# Altium schematic sheet 4_DspBlackfin.SchDoc
size A3; DocumentNumber: 6; SheetNumber: 6; SheetTotal: 8
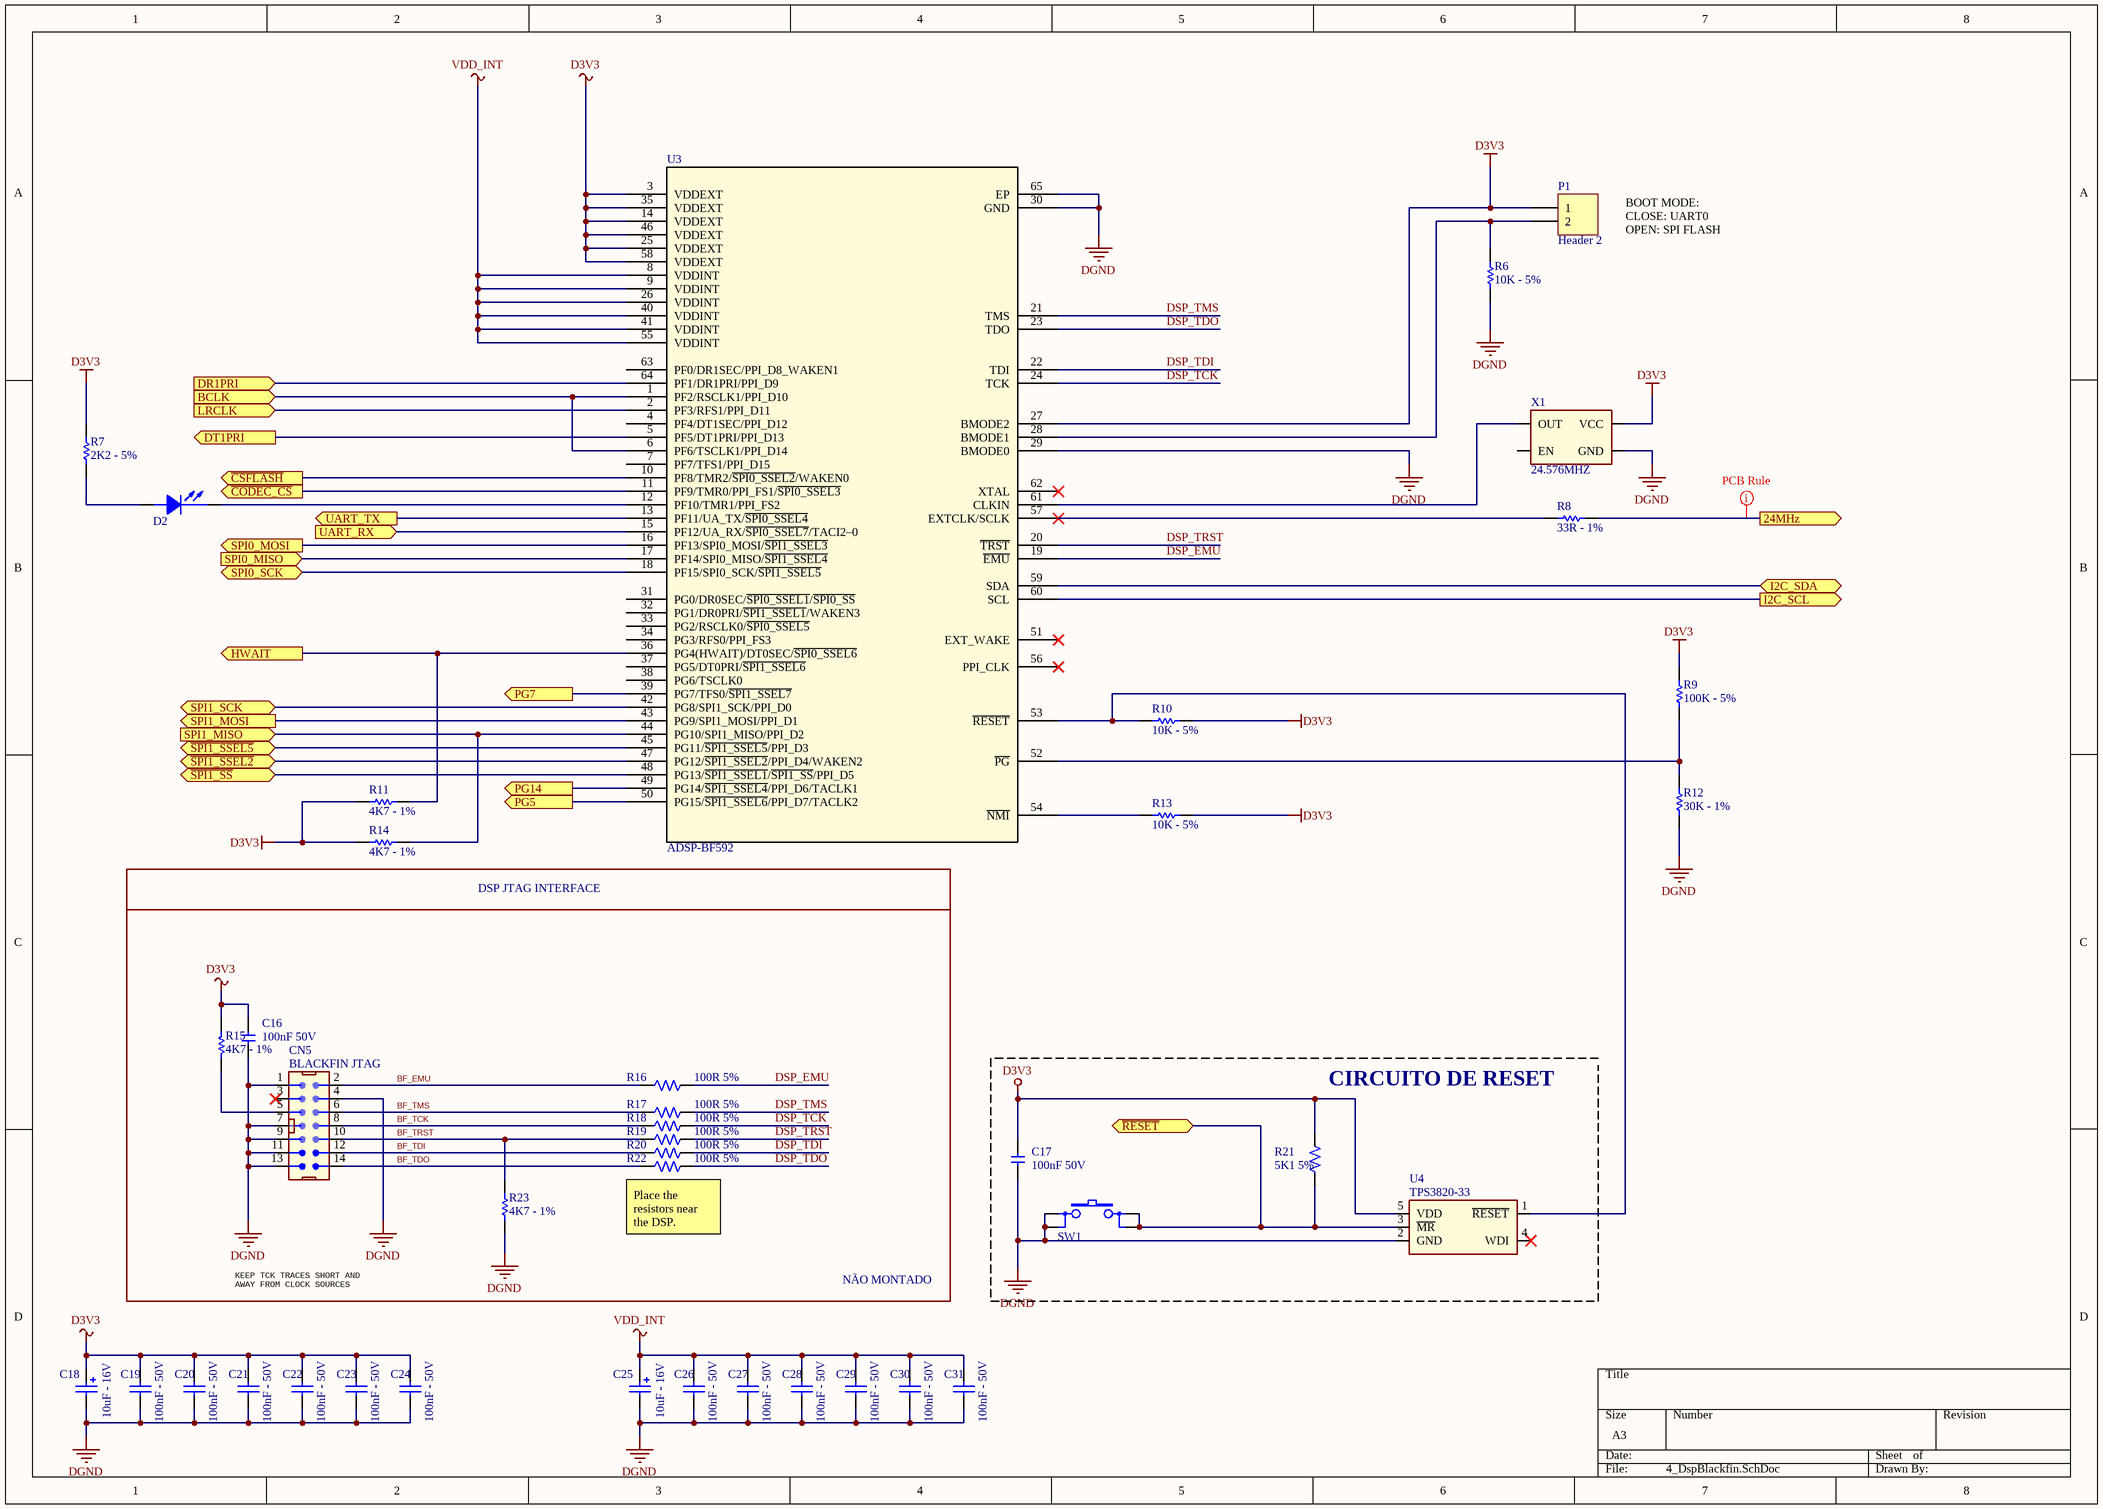
[diagram p0: 4_DspBlackfin.SchDoc]

## Parts
C16  100nF 50V  [SMD0805]
C17  100nF 50V  [SMD0805]
C18  VALOR: 10uF - 16V  [CAP/SMD/ELET/5MM/NP]  (hidden comment: Capacitor 10 uF - 20%)
C19  VALOR: 100nF - 50V  [SMD0805-CAP]  (hidden comment: Capacitor 100 nF - 10%)
C20  VALOR: 100nF - 50V  [SMD0805-CAP]  (hidden comment: Capacitor 100 nF - 10%)
C21  VALOR: 100nF - 50V  [SMD0805-CAP]  (hidden comment: Capacitor 100 nF - 10%)
C22  VALOR: 100nF - 50V  [SMD0805-CAP]  (hidden comment: Capacitor 100 nF - 10%)
C23  VALOR: 100nF - 50V  [SMD0805-CAP]  (hidden comment: Capacitor 100 nF - 10%)
C24  VALOR: 100nF - 50V  [SMD0805-CAP]  (hidden comment: Capacitor 100 nF - 10%)
C25  VALOR: 10uF - 16V  [CAP/SMD/ELET/5MM/NP]  (hidden comment: Capacitor 10 uF - 20%)
C26  VALOR: 100nF - 50V  [SMD0805-CAP]  (hidden comment: Capacitor 100 nF - 10%)
C27  VALOR: 100nF - 50V  [SMD0805-CAP]  (hidden comment: Capacitor 100 nF - 10%)
C28  VALOR: 100nF - 50V  [SMD0805-CAP]  (hidden comment: Capacitor 100 nF - 10%)
C29  VALOR: 100nF - 50V  [SMD0805-CAP]  (hidden comment: Capacitor 100 nF - 10%)
C30  VALOR: 100nF - 50V  [SMD0805-CAP]  (hidden comment: Capacitor 100 nF - 10%)
C31  VALOR: 100nF - 50V  [SMD0805-CAP]  (hidden comment: Capacitor 100 nF - 10%)
CN5  BLACKFIN JTAG  [WALCON.100/IDSC14/W.325/14]
D2  LED 2MM SMD AZUL  [LED\SMD1206]  (value not drawn)
P1  Header 2  [HDR1X2]
R6  VALOR: 10K - 5%  [SMD0805]  (hidden comment: 10K - 5% - 0805 - 328)
R7  VALOR: 2K2 - 5%  [SMD0805]  (hidden comment: 2K2 - 5% - 0805 - 333)
R8  VALOR: 33R - 1%  [SMD0805]  (hidden comment: 33R - 1% - 0805 - 406)
R9  VALOR: 100K - 5%  [SMD0805]  (hidden comment: 100K - 5% - 0805 - 326)
R10  VALOR: 10K - 5%  [SMD0805]  (hidden comment: 10K - 5% - 0805 - 328)
R11  VALOR: 4K7 - 1%  [SMD0805]  (hidden comment: 4K7 - 1% - 0805 - 438)
R12  VALOR: 30K - 1%  [SMD0805]  (hidden comment: 30K- 1% - 0805 - 400)
R13  VALOR: 10K - 5%  [SMD0805]  (hidden comment: 10K - 5% - 0805 - 328)
R14  VALOR: 4K7 - 1%  [SMD0805]  (hidden comment: 4K7 - 1% - 0805 - 438)
R15  VALOR: 4K7 - 1%  [SMD0805]  (hidden comment: 4K7 - 1% - 0805 - 438)
R16  100R 5%  [SMD0805]
R17  100R 5%  [SMD0805]
R18  100R 5%  [SMD0805]
R19  100R 5%  [SMD0805]
R20  100R 5%  [SMD0805]
R21  5K1 5%  [SMD0805]
R22  100R 5%  [SMD0805]
R23  VALOR: 4K7 - 1%  [SMD0805]  (hidden comment: 4K7 - 1% - 0805 - 438)
SW1  Switch TACT, 180G, 4 TERM, 6 X 6MM  [SW/TACT]  (value not drawn)
U3  ADSP-BF592  [CP_64_4]
U4  TPS3820-33  [DBV.95M/5/WG3.00/L3.00]
X1  VALOR: 24.576MHZ  [CRYSTAL/SMD/5X7]  (hidden comment: Crystal 24.576MHZ)

## Ports
24MHz (out), BCLK (in), DR1PRI (in), DT1PRI (out), HWAIT (out), I2C_SCL (out), I2C_SDA (bidir), LRCLK (in), PG5 (out), PG7 (out), PG14 (out), SPI0_MISO (in), SPI0_MOSI (out), SPI0_SCK (bidir), SPI1_MISO (in), SPI1_MOSI (out), SPI1_SCK (bidir), UART_RX (in), UART_TX (out), ~{CODEC_CS} (out), ~{CSFLASH} (out), ~{RESET} (bidir), ~{SPI1_SSEL2} (bidir), ~{SPI1_SSEL5} (bidir), ~{SPI1_SS} (bidir)

## Nets
D3V3: C16.2 C17.2 C18.1 C19.2 C20.1 C21.1 C22.2 C23.2 C24.2 P1.1 R7.2 R9.2 R10.2 R11.2 R13.2 R14.2 R15.2 R21.2 U3.3(VDDEXT) U3.14(VDDEXT) U3.25(VDDEXT) U3.27(BMODE2) U3.35(VDDEXT) U3.46(VDDEXT) U3.58(VDDEXT) U4.5(VDD) X1.4(VCC)
DGND: C16.1 C17.1 C18.2 C19.1 C20.2 C21.2 C22.1 C23.1 C24.1 C25.2 C26.1 C27.2 C28.2 C29.1 C30.1 C31.1 CN5.1 CN5.4 CN5.7 CN5.9 CN5.11 CN5.13 R6.1 R12.1 R23.1 SW1.1 SW1.2 U3.29(BMODE0) U3.30(GND) U3.65(EP) U4.2(GND) X1.2(GND)
VDD_INT: C25.1 C26.2 C27.1 C28.1 C29.2 C30.2 C31.2 U3.8(VDDINT) U3.9(VDDINT) U3.26(VDDINT) U3.40(VDDINT) U3.41(VDDINT) U3.55(VDDINT)
24MHz: R8.2 ; port 24MHz
~{CODEC_CS}: U3.11(PF9/TMR0/PPI_FS1/~{SPI0_SSEL3}) ; port ~{CODEC_CS}
~{CSFLASH}: U3.10(PF8/TMR2/~{SPI0_SSEL2}/WAKEN0) ; port ~{CSFLASH}
~{RESET}: R21.1 SW1.3 SW1.4 U4.3(~{MR}) ; port ~{RESET}
~{SPI1_SS}: U3.48(PG13/~{SPI1_SSEL1}/~{SPI1_SS}/PPI_D5) ; port ~{SPI1_SS}
~{SPI1_SSEL2}: U3.47(PG12/~{SPI1_SSEL2}/PPI_D4/WAKEN2) ; port ~{SPI1_SSEL2}
~{SPI1_SSEL5}: U3.45(PG11/~{SPI1_SSEL5}/PPI_D3) ; port ~{SPI1_SSEL5}
BCLK: U3.1(PF2/RSCLK1/PPI_D10) U3.6(PF6/TSCLK1/PPI_D14) ; port BCLK
BF_EMU: CN5.2 R16.1
BF_TCK: CN5.8 R18.1
BF_TDI: CN5.12 R20.1
BF_TDO: CN5.14 R22.1
BF_TMS: CN5.6 R17.1
BF_TRST: CN5.10 R19.1 R23.2
DR1PRI: U3.64(PF1/DR1PRI/PPI_D9) ; port DR1PRI
DSP_EMU: R16.2 U3.19(~{EMU})
DSP_TCK: R18.2 U3.24(TCK)
DSP_TDI: R20.2 U3.22(TDI)
DSP_TDO: R22.2 U3.23(TDO)
DSP_TMS: R17.2 U3.21(TMS)
DSP_TRST: R19.2 U3.20(~{TRST})
DT1PRI: U3.5(PF5/DT1PRI/PPI_D13) ; port DT1PRI
HWAIT: R11.1 U3.36(PG4(HWAIT)/DT0SEC/~{SPI0_SSEL6}) ; port HWAIT
I2C_SCL: U3.60(SCL) ; port I2C_SCL
I2C_SDA: U3.59(SDA) ; port I2C_SDA
LRCLK: U3.2(PF3/RFS1/PPI_D11) ; port LRCLK
PG5: U3.50(PG15/~{SPI1_SSEL6}/PPI_D7/TACLK2) ; port PG5
PG7: U3.39(PG7/TFS0/~{SPI1_SSEL7}) ; port PG7
PG14: U3.49(PG14/~{SPI1_SSEL4}/PPI_D6/TACLK1) ; port PG14
SPI0_MISO: U3.17(PF14/SPI0_MISO/~{SPI1_SSEL4}) ; port SPI0_MISO
SPI0_MOSI: U3.16(PF13/SPI0_MOSI/~{SPI1_SSEL3}) ; port SPI0_MOSI
SPI0_SCK: U3.18(PF15/SPI0_SCK/~{SPI1_SSEL5}) ; port SPI0_SCK
SPI1_MISO: R14.1 U3.44(PG10/SPI1_MISO/PPI_D2) ; port SPI1_MISO
SPI1_MOSI: U3.43(PG9/SPI1_MOSI/PPI_D1) ; port SPI1_MOSI
SPI1_SCK: U3.42(PG8/SPI1_SCK/PPI_D0) ; port SPI1_SCK
UART_RX: U3.15(PF12/UA_RX/~{SPI0_SSEL7}/TACI2–0) ; port UART_RX
UART_TX: U3.13(PF11/UA_TX/~{SPI0_SSEL4}) ; port UART_TX
NetCN5_5: CN5.5 R15.1
NetD2_1: D2.1(ANODE) R7.1
NetD2_2: D2.2(CATHODE) U3.12(PF10/TMR1/PPI_FS2)
NetP1_2: P1.2 R6.2 U3.28(BMODE1)
NetR8_1: R8.1 U3.57(EXTCLK/SCLK)
NetR9_1: R9.1 R12.2 U3.52(~{PG})
NetR10_1: R10.1 U3.53(~{RESET}) U4.1(~{RESET})
NetR13_1: R13.1 U3.54(~{NMI})
NetU3_61: U3.61(CLKIN) X1.3(OUT)

Not connected (* = marked no-connect by the designer): CN5 3*; U3 4(PF4/DT1SEC/PPI_D12) 7(PF7/TFS1/PPI_D15) 31(PG0/DR0SEC/~{SPI0_SSEL1}/~{SPI0_SS}) 32(PG1/DR0PRI/~{SPI1_SSEL1}/WAKEN3) 33(PG2/RSCLK0/~{SPI0_SSEL5}) 34(PG3/RFS0/PPI_FS3) 37(PG5/DT0PRI/~{SPI1_SSEL6}) 38(PG6/TSCLK0) 51(EXT_WAKE)* 56(PPI_CLK)* 62(XTAL)* 63(PF0/DR1SEC/PPI_D8_WAKEN1); U4 4(WDI)*; X1 1(EN)

## Layout directives
rule Undefined; Impedance: 50: 24MHz

## Notes on the sheet
- BOOT MODE:
  CLOSE: UART0
  OPEN: SPI FLASH
- DSP JTAG INTERFACE
- CIRCUITO DE RESET
- (near R22) Place the resistors near the DSP.
- KEEP TCK TRACES SHORT AND
  AWAY FROM CLOCK SOURCES
- NÃO MONTADO

## Library data of the parts
C16 = 100nF 50V Z 0805 CCM 1760: MANUFACTURER: AVX; PARTNUMBER: 08055G104ZAT2A; CODE: 1760; DESC: CAP 100nF, 50V, SMD0805, Z%, Y5V, CERAMICO MULTICAMADA; VOLTAGE: CMAX; PSpiceTemplate: C^@REFDES %1 %2 ?TOLERANCE|C^@REFDES| @VALUE ?IC/IC=@IC/ ?TOLERANCE|\n.model C^@REFDES CAP C=1 DEV=@TOLERANCE%|; COMPSIDE: TOP; COMPLOC: [712.500,1512.500]; COMPROT: 90; COMPGROUP: 0; COMPFIXED: NO; COMPHEIGHT: 0.000; Value: 100nF 50V; COMPLOCKED: NO; COMPKEY: NO; DECOUPLER: NO; MEMORY: NO
C17 = 100nF 50V Z 0805 CCM 1760: MANUFACTURER: AVX; PARTNUMBER: 08055G104ZAT2A; CODE: 1760; DESC: CAP 100nF, 50V, SMD0805, Z%, Y5V, CERAMICO MULTICAMADA; VOLTAGE: CMAX; PSpiceTemplate: C^@REFDES %1 %2 ?TOLERANCE|C^@REFDES| @VALUE ?IC/IC=@IC/ ?TOLERANCE|\n.model C^@REFDES CAP C=1 DEV=@TOLERANCE%|; COMPSIDE: TOP; COMPLOC: [9537.500,4387.500]; COMPROT: 270; COMPGROUP: 0; COMPFIXED: NO; COMPHEIGHT: 0.000; Value: 100nF 50V; COMPLOCKED: NO; COMPKEY: NO; DECOUPLER: NO; MEMORY: NO
C18 C25 = 10uF - 16V - 20% - 5x11 - 3052: Capacitor 10uF, 20%, SMD 0805 5mm D x 5.8mm L; MANUFACTURER: NICHICON; PARTNUMBER: UUP1C100MCL1GS; CODIGO: 3052; EMBALAGEM: RELL; FORNECEDOR: VARIOS; DESC: CAP 10uF, 16V, C 5 X 11, ELCO SMD, NON POLARIZED; ComponentLink1Description: Datasheet; ComponentLink1URL: http://www.mouser.com/ds/2/293/e-up-27686.pdf; ComponentLink2Description: HOME NICHICON; ComponentLink2URL: http://nichicon-us.com/english/index.html; ENCAPSULAMENTO: CAP/SMD/ELET/5MM/NP; FACTORY PACK: 1000; LOCALIZAÇÃO: *; Supplier 1: Mouser; Supplier Part Number 1: 647-UUP1C100MCL1GS
C19-C24 C26-C31 = 100nF - 50V - 10% - 0805 - 580: Capacitor 100nF, 10%, SMD 0805; MANUFACTURER: AVX; PARTNUMBER: 08055C104KAT2A; CODIGO: 580; EMBALAGEM: REEL; FORNECEDOR: VARIOS; DESC: CAP 100nF, 50V, SMD0805, 10%, X7R, CERAMICO MULTICAMADA; TARGET MÁX U$: $0,0041; ComponentLink1Description: Datasheet; ComponentLink1URL: http://www.avx.com/docs/catalogs/cx7r.pdf; ComponentLink2Description: HOME AVX; ComponentLink2URL: http://www.avx.com/; ENCAPSULAMENTO: SMD0805; FACTORY PACK: 4000; LOCALIZAÇÃO: *; Supplier 1: Mouser; Supplier Part Number 1: 08055C104KAT2A; NCM: 8532.21.11
CN5 = IDC BOX HEADER 14P 762: PARTNUMBER: IDCSC-14; MANUFACTURER: METALTEX; DESC: CNC PCI, IDC BOX HEADER, 14P, 180G, SEM EJETOR; CODE: 762; COMPHEIGHT: 0.000; MEMORY: NO; COMPGROUP: 0; COMPROT: 270; COMPLOC: [212.500,1475.000]; COMPSIDE: TOP; DECOUPLER: NO; COMPKEY: NO; COMPLOCKED: NO; COMPFIXED: NO
D2 = LED 2MM SMD1206 AZUL - 3220: MANUFACTURER: DIALIGHT; PARTNUMBER: 598-8291-107F; DESC: LED 2MM, SMD1206, AZUL, 90MCD, 140G, DIFUSO; CODIGO: 3220; EMBALAGEM: REEL; ENCAPSULAMENTO: LED SMD; FORNECEDOR: MOUSER; ComponentLinK1Description: Datasheet; ComponentLink1URL: http://media.digikey.com/pdf/Data%20Sheets/Dialight%20PDFs/598_Series_1206_Pkg.pdf; ComponentLink2Description: HOME DIALIGHT; ComponentLink2URL: www.dialight.com; FACTORY PACK: 3000; LOCALIZAÇÃO: *; VALOR: LED 2MM SMD AZUL; Supplier Part Number 1: 645-598-8291-107F
P1 = Header 2: Header, 2-Pin; LatestRevisionDate: 17-Jul-2002; LatestRevisionNote: Re-released for DXP Platform.; Publisher: Altium Limited
R6 R10 R13 = 10K - 5% - 0805 - 328: Resistor 10K, 5%, SMD 0805; PARTNUMBER: RC2012J103CS; MANUFACTURER: SAMSUNG; CODIGO: 328; EMBALAGEM: REEL; FORNECEDOR: VARIOS; DESC: RES 10K, 5%, SMD 0805, MF; TARGET MÁX U$: $0.0012; ENCAPSULAMENTO: SMD0805; FACTORY PACK: 5000; ComponentLink1URL: http://media.digikey.com/pdf/Data%20Sheets/Samsung%20PDFs/CHIP_RESISTOR_Catalog.pdf; ComponentLink1Description: Datasheet; ComponentLink2Description: HOME SANSUNG; ComponentLink2URL: http://www.samsung.com/global/business/semiconductor/; Supplier 1: Digi-Key; Supplier Part Number 1: 1276-5552-1-ND; NCM: 8533.21.20
R7 = 2K2 - 5% - 0805 - 333: Resistor 2K2, 5%, SMD 0805; PARTNUMBER: RC2012J222CS; MANUFACTURER: SAMSUNG; CODIGO: 333; EMBALAGEM: REEL; FORNECEDOR: VARIOS; DESC: RES 2K2, 5%, SMD 0805, MF; TARGET MÁX U$: $0.0015; LOCALIZAÇÃO: *; ENCAPSULAMENTO: SMD0805; FACTORY PACK: 5000; Supplier 1: AVNET; Supplier Part Number 1: RC2012J222CS; ComponentLink1Description: Datasheet; ComponentLink1URL: http://download.siliconexpert.com/pdfs/2011/2/28/4/59/40/979/sam_/manual/resistor-general1.pdf; ComponentLink2Description: HOME SAMSUNG; ComponentLink2URL: http://www.samsung.com/global/business/semiconductor/; NCM: 8533.21.20
R8 = 33R - 1% - 0805 - 406: Resistor 33R 1%, SMD 0805; PARTNUMBER: RC2012F33R0CS; MANUFACTURER: SAMSUNG; CODIGO: 406; EMBALAGEM: REEL; FORNECEDOR: VARIOS; DESC: RES 33R, 1%, SMD 0805, MF; TARGET MÁX U$: $0.0015; LOCALIZAÇÃO: *; ENCAPSULAMENTO: SMD0805; FACTORY PACK: 5000; ComponentLink1Description: Datasheet; ComponentLink1URL: http://download.siliconexpert.com/pdfs/2013/2/17/18/59/11/464/koa_/manual/104rk73h.pdf; ComponentLink2Description: KOA Speer Electronics webpage; ComponentLink2URL: http://www.koaspeer.com/; Supplier 1: MOUSER; Supplier Part Number 1: RC2012F33R0CS; NCM: 8533.21.20
R9 = 100K - 5% - 0805 - 326: Resistor 100K, 5%, SMD 0805; PARTNUMBER: RC2012J104CS; MANUFACTURER: SAMSUNG; CODIGO: 326; EMBALAGEM: REEL; FORNECEDOR: VARIOS; DESC: RES 100K, 5%, SMD 0805, MF; TARGET MÁX U$: $0.0012; LOCALIZAÇÃO: *; ENCAPSULAMENTO: SMD0805; FACTORY PACK: 5000; ComponentLink1Description: Datasheet; ComponentLink1URL: http://media.digikey.com/pdf/Data%20Sheets/Samsung%20PDFs/CHIP_RESISTOR_Catalog.pdf; ComponentLink2Description: HOME SANSUNG; ComponentLink2URL: http://www.samsung.com/global/business/semiconductor/; Supplier 1: Digi-Key; Supplier Part Number 1: 1276-5576-1-ND; NCM: 8533.21.20
R11 R14 R23 = 4K7 - 1% - 0805 - 438: Resistor 4K7, 1%, SMD 0805; PARTNUMBER: RC2012F4701CS; MANUFACTURER: SAMSUNG; CODIGO: 438; EMBALAGEM: REEL; FORNECEDOR: VARIOS; DESC: RES 4K7, 1%, SMD 0805, MF; TARGET MÁX U$: $0.0015; LOCALIZAÇÃO: *; ENCAPSULAMENTO: SMD0805; FACTORY PACK: 5000; ComponentLink1Description: Datasheet; ComponentLink1URL: http://avnetexpress.avnet.com/store/em/EMController/_/A-5002847207733/An-0?action=part&catalogId=500201&langId=-1&storeId=500201&CMP=KNC-SupplyFrame_VSE-T11; ComponentLink2Description: HOME SAMSUNG; ComponentLink2URL: http://www.samsung.com/global/business/semiconductor/; Supplier 1: AVNET; Supplier Part Number 1: RC2012F4701CS; NCM: 8533.21.20
R12 = 30K - 1% - 0805 - 401: Resistor 30K, 1%, SMD 0805; PARTNUMBER: ERJ-6ENF3002V; MANUFACTURER: Vishay Dale; CODIGO: 401; EMBALAGEM: REEL; FORNECEDOR: VARIOS; DESC: RES 30K, 1%, SMD 0805, MF; TARGET MÁX U$: $0.0015; LOCALIZAÇÃO: *; ENCAPSULAMENTO: SMD0805; FACTORY PACK: 5000; ComponentLink1Description: Datasheet; ComponentLink1URL: http://www.vishay.com/docs/20035/dcrcwe3.pdf; ComponentLink2Description: Vishay Homepage; ComponentLink2URL: http://www.vishay.com/; Supplier 1: AVNET; Supplier Part Number 1: CRCW0805300RFKEA; NCM: 8533.21.20
R15 = 4K7 - 1% - 0805 - 438: Resistor 4K7, 1%, SMD 0805; PARTNUMBER: RC2012F4701CS; MANUFACTURER: SAMSUNG; DESC: RES 4K7, 1%, SMD 0805, MF; CODIGO: 438; EMBALAGEM: REEL; FORNECEDOR: VARIOS; TARGET MÁX U$: $0.0015; LOCALIZAÇÃO: *; ENCAPSULAMENTO: SMD0805; FACTORY PACK: 5000; ComponentLink1Description: Datasheet; ComponentLink1URL: http://avnetexpress.avnet.com/store/em/EMController/_/A-5002847207733/An-0?action=part&catalogId=500201&langId=-1&storeId=500201&CMP=KNC-SupplyFrame_VSE-T11; ComponentLink2Description: HOME SAMSUNG; ComponentLink2URL: http://www.samsung.com/global/business/semiconductor/; Supplier 1: AVNET; Supplier Part Number 1: RC2012F4701CS; NCM: 8533.21.20
R16 = 100R 5% 0805 327: MANUFACTURER: SAMSUNG; PARTNUMBER: RC2012J101CS; CODE: 327; DESC: RES 100R, 5%, SMD 0805, MF; COMPFIXED: NO; COMPGROUP: 0; COMPHEIGHT: 0.000; COMPLOC: [800.000,787.500]; COMPROT: 90; COMPSIDE: TOP; COMPKEY: NO; COMPLOCKED: NO; DECOUPLER: NO; MEMORY: NO
R17 = 100R 5% 0805 327: MANUFACTURER: SAMSUNG; PARTNUMBER: RC2012J101CS; CODE: 327; DESC: RES 100R, 5%, SMD 0805, MF; COMPFIXED: NO; COMPGROUP: 0; COMPHEIGHT: 0.000; COMPLOC: [875.000,887.500]; COMPROT: 270; COMPSIDE: TOP; COMPKEY: NO; COMPLOCKED: NO; DECOUPLER: NO; MEMORY: NO
R18 = 100R 5% 0805 327: MANUFACTURER: SAMSUNG; PARTNUMBER: RC2012J101CS; CODE: 327; DESC: RES 100R, 5%, SMD 0805, MF; COMPFIXED: NO; COMPGROUP: 0; COMPHEIGHT: 0.000; COMPLOC: [562.500,1512.500]; COMPROT: 90; COMPSIDE: TOP; COMPKEY: NO; COMPLOCKED: NO; DECOUPLER: NO; MEMORY: NO
R19 = 100R 5% 0805 327: MANUFACTURER: SAMSUNG; PARTNUMBER: RC2012J101CS; CODE: 327; DESC: RES 100R, 5%, SMD 0805, MF; COMPFIXED: NO; COMPGROUP: 0; COMPHEIGHT: 0.000; COMPLOC: [650.000,887.500]; COMPROT: 270; COMPSIDE: TOP; COMPKEY: NO; COMPLOCKED: NO; DECOUPLER: NO; MEMORY: NO
R20 = 100R 5% 0805 327: MANUFACTURER: SAMSUNG; PARTNUMBER: RC2012J101CS; CODE: 327; DESC: RES 100R, 5%, SMD 0805, MF; COMPFIXED: NO; COMPGROUP: 0; COMPHEIGHT: 0.000; COMPLOC: [500.000,887.500]; COMPROT: 270; COMPSIDE: TOP; COMPKEY: NO; COMPLOCKED: NO; DECOUPLER: NO; MEMORY: NO
R21 = 5K1 5% 0805 1368: MANUFACTURER: SAMSUNG; PARTNUMBER: RC2012J512CS; CODE: 1368; DESC: RES 5K1, 5%, SMD 0805, MF; COMPSIDE: TOP; COMPLOC: [9775.000,4462.500]; COMPROT: 180; COMPGROUP: 0; COMPFIXED: NO; COMPHEIGHT: 0.000; COMPLOCKED: NO; COMPKEY: NO; DECOUPLER: NO; MEMORY: NO
R22 = 100R 5% 0805 327: MANUFACTURER: SAMSUNG; PARTNUMBER: RC2012J101CS; CODE: 327; DESC: RES 100R, 5%, SMD 0805, MF; COMPFIXED: NO; COMPGROUP: 0; COMPHEIGHT: 0.000; COMPLOC: [575.000,787.500]; COMPROT: 90; COMPSIDE: TOP; COMPKEY: NO; COMPLOCKED: NO; DECOUPLER: NO; MEMORY: NO
SW1 = Switch TACT 9.5mm - 1224: MANUFACTURER: METALTEX; PARTNUMBER: A06-9.5; DESC: CHAVE TACT, 180G, 4 TERM, 6 X 6MM, 9.5MM; CODIGO: 1224; VALOR: TACT, 180G, 4 TERM, 6 X 6MM; ComponentLinK1Description: Datasheet; ComponentLink1URL: *; ComponentLink2Description: HOME METALTEX; ComponentLink2URL: www.metaltex.com.br; EMBALAGEM: *; ENCAPSULAMENTO: *; FACTORY PACK: *; FORNECEDOR: METALTEX; LOCALIZAÇÃO: *
U3 = ADSP-BF592BCPZ: Imported; Value: ADSP-BF592; Type: Type; RefDes: RefDes
U4 = TPS3820-33 (SOT23) 3494: MANUFACTURER: TEXAS INSTRUMENTS; PARTNUMBER: TPS3820-33DBVR; DESC: TPS3820-33DBVR, PROCESSOR SUPERVISORY CIRCUITS, DBV, SOT-23; CODE: 3494; COMPFIXED: NO; COMPGROUP: 0; COMPHEIGHT: 10.000; COMPLOC: [9775.000,4300.000]; COMPROT: 180; COMPSIDE: TOP; COMPKEY: NO; COMPLOCKED: NO; DECOUPLER: NO; MEMORY: NO
X1 = Crystal 24.576MHZ 20PPM SMD - 3063: PARTNUMBER: ASV-24.576MHZ-EJ-T; MANUFACTURER: ABRACON; CODIGO: 3063; DESC: OSCILADOR, SMD 5 X 7MM, 3.3V, 20PPM, 24.576MHZ; EMBALAGEM: REEL; ENCAPSULAMENTO: SMD; FORNECEDOR: MOUSER; ComponentLinK1Description: Datasheet; ComponentLink1URL: http://www.mouser.com/ds/2/3/ASV-24925.pdf; ComponentLink2Description: HOME ABRACON; ComponentLink2URL: www.abracon.com; FACTORY PACK: 1000; LOCALIZAÇÃO: *; Supplier 1: Mouser; Supplier Part Number 1: 815-ASV-24.576-EJ-T